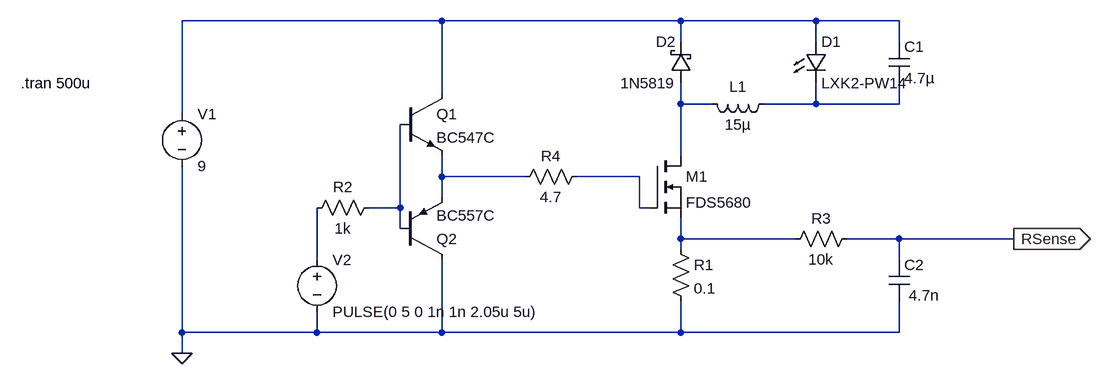
[diagram p0: schematic leddriver-20120912-leds.asc]
leddriver-20120912-leds.asc, the LTspice schematic file:
Version 4
SHEET 1 1460 680
WIRE -352 -64 -752 -64
WIRE 16 -64 -352 -64
WIRE 224 -64 16 -64
WIRE 352 -64 224 -64
WIRE 16 -32 16 -64
WIRE 224 -32 224 -64
WIRE 352 -32 352 -64
WIRE -352 48 -352 -64
WIRE 16 64 16 32
WIRE 64 64 16 64
WIRE 224 64 224 32
WIRE 224 64 144 64
WIRE 352 64 352 32
WIRE 352 64 224 64
WIRE -752 80 -752 -64
WIRE 16 144 16 64
WIRE -352 176 -352 144
WIRE -224 176 -352 176
WIRE -48 176 -144 176
WIRE -352 208 -352 176
WIRE -416 224 -416 96
WIRE -416 224 -464 224
WIRE -48 224 -48 176
WIRE -32 224 -48 224
WIRE -416 256 -416 224
WIRE 16 272 16 240
WIRE 192 272 16 272
WIRE 352 272 272 272
WIRE 528 272 352 272
WIRE 16 288 16 272
WIRE -544 304 -544 224
WIRE 352 304 352 272
WIRE -752 416 -752 160
WIRE -544 416 -544 384
WIRE -544 416 -752 416
WIRE -352 416 -352 304
WIRE -352 416 -544 416
WIRE 16 416 16 368
WIRE 16 416 -352 416
WIRE 352 416 352 368
WIRE 352 416 16 416
WIRE -752 448 -752 416
FLAG -752 448 0
FLAG 528 272 RSense
IOPIN 528 272 Out
SYMBOL voltage -752 64 R0
WINDOW 123 0 0 Left 2
WINDOW 39 0 0 Left 2
SYMATTR InstName V1
SYMATTR Value 9
SYMBOL nmos -32 144 R0
SYMATTR InstName M1
SYMATTR Value FDS5680
SYMBOL res 0 272 R0
SYMATTR InstName R1
SYMATTR Value 0.1
SYMBOL voltage -544 288 R0
WINDOW 123 0 0 Left 2
WINDOW 39 0 0 Left 2
SYMATTR InstName V2
SYMATTR Value PULSE(0 5 0 1n 1n 2.05u 5u)
SYMBOL ind 160 48 R90
WINDOW 0 5 56 VBottom 2
WINDOW 3 32 56 VTop 2
SYMATTR InstName L1
SYMATTR Value 15µ
SYMBOL schottky 32 32 R180
WINDOW 0 24 64 Left 2
WINDOW 3 24 0 Left 2
SYMATTR InstName D2
SYMATTR Value 1N5819
SYMATTR Description Diode
SYMATTR Type diode
SYMBOL res -448 208 R90
WINDOW 0 0 56 VBottom 2
WINDOW 3 32 56 VTop 2
SYMATTR InstName R2
SYMATTR Value 1k
SYMBOL npn -416 48 R0
SYMATTR InstName Q1
SYMATTR Value BC547C
SYMBOL pnp -416 304 M180
SYMATTR InstName Q2
SYMATTR Value BC557C
SYMBOL res 288 256 R90
WINDOW 0 0 56 VBottom 2
WINDOW 3 32 56 VTop 2
SYMATTR InstName R3
SYMATTR Value 10k
SYMBOL cap 336 304 R0
WINDOW 3 31 55 Left 2
SYMATTR Value 4.7n
SYMATTR InstName C2
SYMBOL res -128 160 R90
WINDOW 0 0 56 VBottom 2
WINDOW 3 32 56 VTop 2
SYMATTR InstName R4
SYMATTR Value 4.7
SYMBOL cap 336 -32 R0
SYMATTR InstName C1
SYMATTR Value 4.7µ
SYMBOL LED 208 -32 R0
SYMATTR InstName D1
SYMATTR Value LXK2-PW14
SYMATTR Description Diode
SYMATTR Type diode
TEXT -1000 32 Left 2 !.tran 500u

The netlist it stands for:
* leddriver-20120912-leds.asc
V1 N001 0 9
M1 N002 N005 N007 N007 FDS5680
R1 N007 0 0.1
V2 N008 0 PULSE(0 5 0 1n 1n 2.05u 5u)
L1 N003 N002 15µ
D2 N002 N001 1N5819
R2 N006 N008 1k
Q1 N001 N006 N004 0 BC547C
Q2 0 N006 N004 0 BC557C
R3 RSense N007 10k
C2 RSense 0 4.7n
R4 N005 N004 4.7
C1 N001 N003 4.7µ
D1 N001 N003 LXK2-PW14
.model D D
.lib standard.dio
.model NPN NPN
.model PNP PNP
.lib standard.bjt
.model NMOS NMOS
.model PMOS PMOS
.lib standard.mos
.tran 500u
.backanno
.end